# Altium project DC_Electronic_Load.PrjPcb
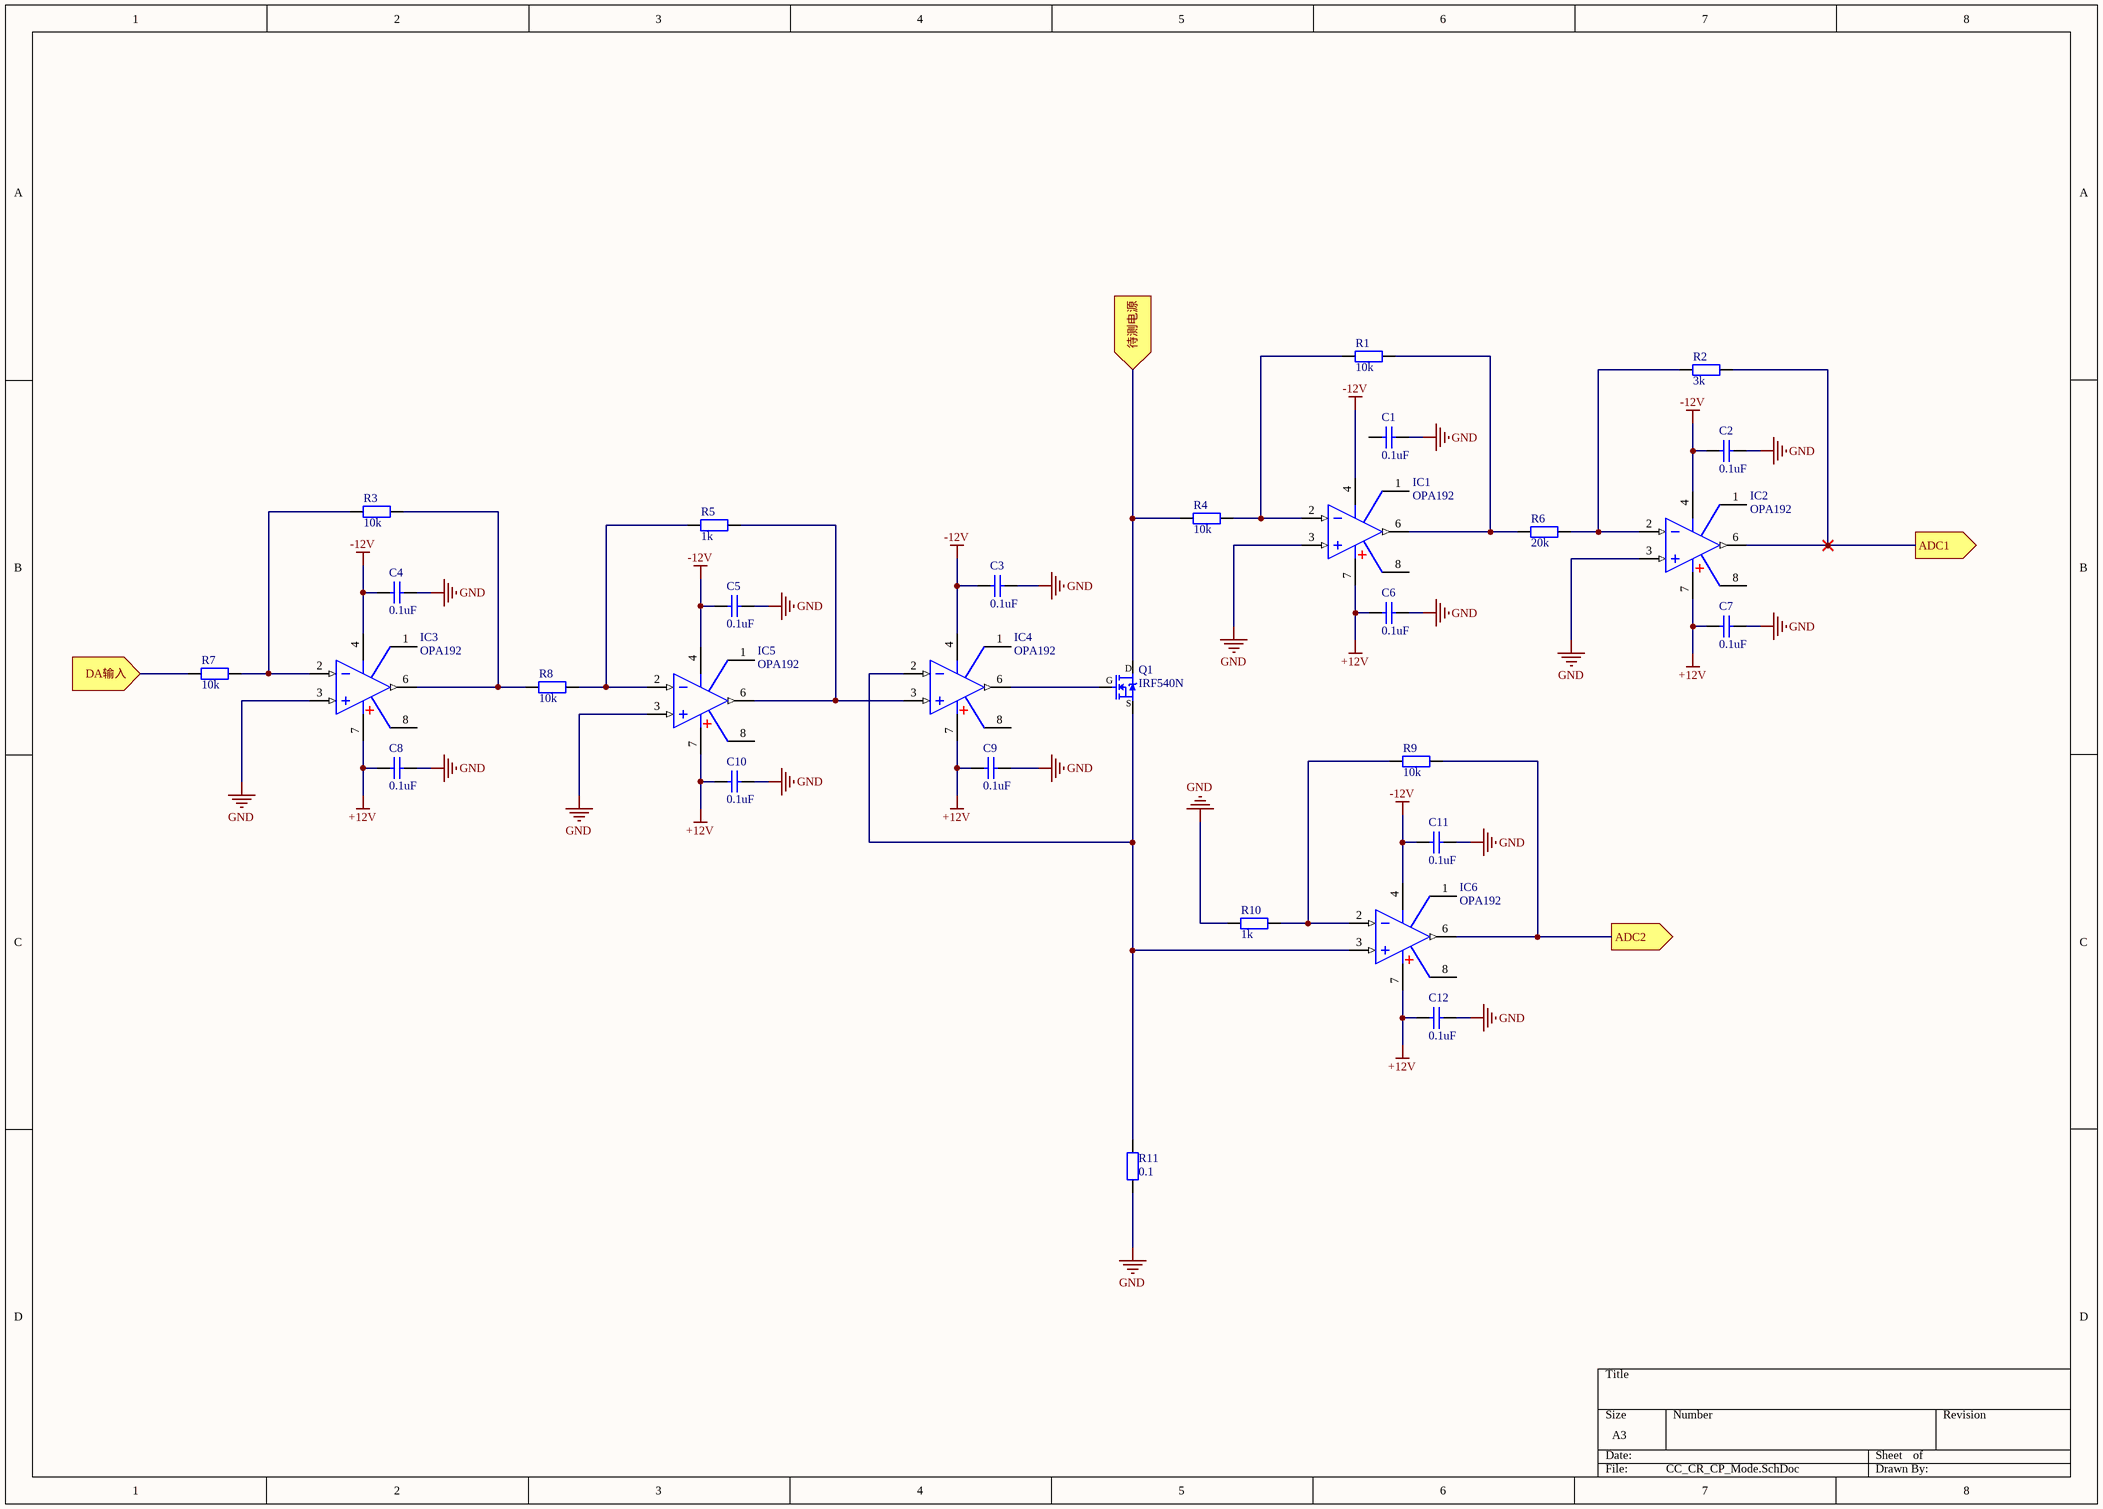
[diagram p0: CC_CR_CP_Mode.SchDoc]
4 sheets, 100 parts. Net scope: flat (ports and power ports of the same name join across sheets).
Board file: DC_Electronic_Load.PcbDoc
Sheets:
  CC_CR_CP_Mode.SchDoc
  CV_Mode.SchDoc
  Sheet1.SchDoc
  Sheet2.SchDoc

## Sheet CC_CR_CP_Mode.SchDoc
size A3; SheetNumber: 1; SheetTotal: 2

### Parts
C1  0.1uF  [瓷片电容]
C2  0.1uF  [瓷片电容]
C3  0.1uF  [瓷片电容]
C4  0.1uF  [瓷片电容]
C5  0.1uF  [瓷片电容]
C6  0.1uF  [瓷片电容]
C7  0.1uF  [瓷片电容]
C8  0.1uF  [瓷片电容]
C9  0.1uF  [瓷片电容]
C10  0.1uF  [瓷片电容]
C11  0.1uF  [瓷片电容]
C12  0.1uF  [瓷片电容]
IC1  OPA192  [SOP8_N]
IC2  OPA192  [SOP8_N]
IC3  OPA192  [SOP8_N]
IC4  OPA192  [SOP8_N]
IC5  OPA192  [SOP8_N]
IC6  OPA192  [SOP8_N]
Q1  IRF540N  [TO263-3B]
R1  10k  [RS 1/4W]
R2  3k  [RS 1/4W]
R3  10k  [RS 1/4W]
R4  10k  [RS 1/4W]
R5  1k  [RS 1/4W]
R6  20k  [RS 1/4W]
R7  10k  [RS 1/4W]
R8  10k  [RS 1/4W]
R9  10k  [RS 1/4W]
R10  1k  [RS 1/4W]
R11  0.1  [RS 1/4W]

### Ports
ADC1 (out), ADC2 (out), DA输入 (in), 待测电源 (in)

### Nets
+12V: C6.1 C7.1 C8.1 C9.1 C10.1 C12.1 IC1.7(V+) IC2.7(V+) IC3.7(V+) IC4.7(V+) IC5.7(V+) IC6.7(V+)
-12V: C2.1 C3.1 C4.1 C5.1 C11.1 IC1.4(V-) IC2.4(V-) IC3.4(V-) IC4.4(V-) IC5.4(V-) IC6.4(V-)
GND: C1.2 C2.2 C3.2 C4.2 C5.2 C6.2 C7.2 C8.2 C9.2 C10.2 C11.2 C12.2 IC1.3(IN+) IC2.3(IN+) IC3.3(IN+) IC5.3(IN+) R10.1 R11.1
NetIC1_2: IC1.2(IN-) R1.1 R4.2
NetIC1_6: IC1.6(OUT) R1.2 R6.1
NetIC2_2: IC2.2(IN-) R2.1 R6.2
NetIC2_6: IC2.6(OUT) R2.2 ; port ADC1
NetIC3_2: IC3.2(IN-) R3.1 R7.2
NetIC3_6: IC3.6(OUT) R3.2 R8.1
NetIC4_2: IC4.2(IN-) IC6.3(IN+) Q1.3(D) R11.2
NetIC4_3: IC4.3(IN+) IC5.6(OUT) R5.2
NetIC4_6: IC4.6(OUT) Q1.1(G)
NetIC5_2: IC5.2(IN-) R5.1 R8.2
NetIC6_2: IC6.2(IN-) R9.1 R10.2
NetIC6_6: IC6.6(OUT) R9.2 ; port ADC2
NetIC10_3: R7.1 ; port DA输入
NetQ1_2: Q1.2(S) R4.1 ; port 待测电源

Not connected (* = marked no-connect by the designer): C1 1; IC1 1 8; IC2 1 8; IC3 1 8; IC4 1 8; IC5 1 8; IC6 1 8

### Library data of the parts
C1-C12 = Cap_DIP: 直插电容; Value: 100nF; Voltage: 63V; Published: 8-Jun-2000; Revision: July-2002: Re-released for DXP Platform.; Publisher: Altium Limited; 实物样品照片: https://item.taobao.com/item.htm?spm=a230r.1.14.32.21fd24b7VWml4d&id=37914290992&ns=1&abbucket=13#detail
IC1-IC6 = OPA192: High-Voltage, Rail-to-Rail Input/Output, 5µV, 0.2µV/˚C, Precision Operational Amplifier; BOM名称: 单路精密运放; 版权归属: 源创客; 学习资源: www.ooocke.com
Q1 = IRF540N: N沟场 100V/22A; BOM名称: 效应管; 版权归属: 源创客; 学习资源: www.ooocke.com; 描述: N沟场 100V/22A
R1-R11 = Res_DIP: 直插电阻

## Sheet CV_Mode.SchDoc
size A3; SheetNumber: 2; SheetTotal: 4
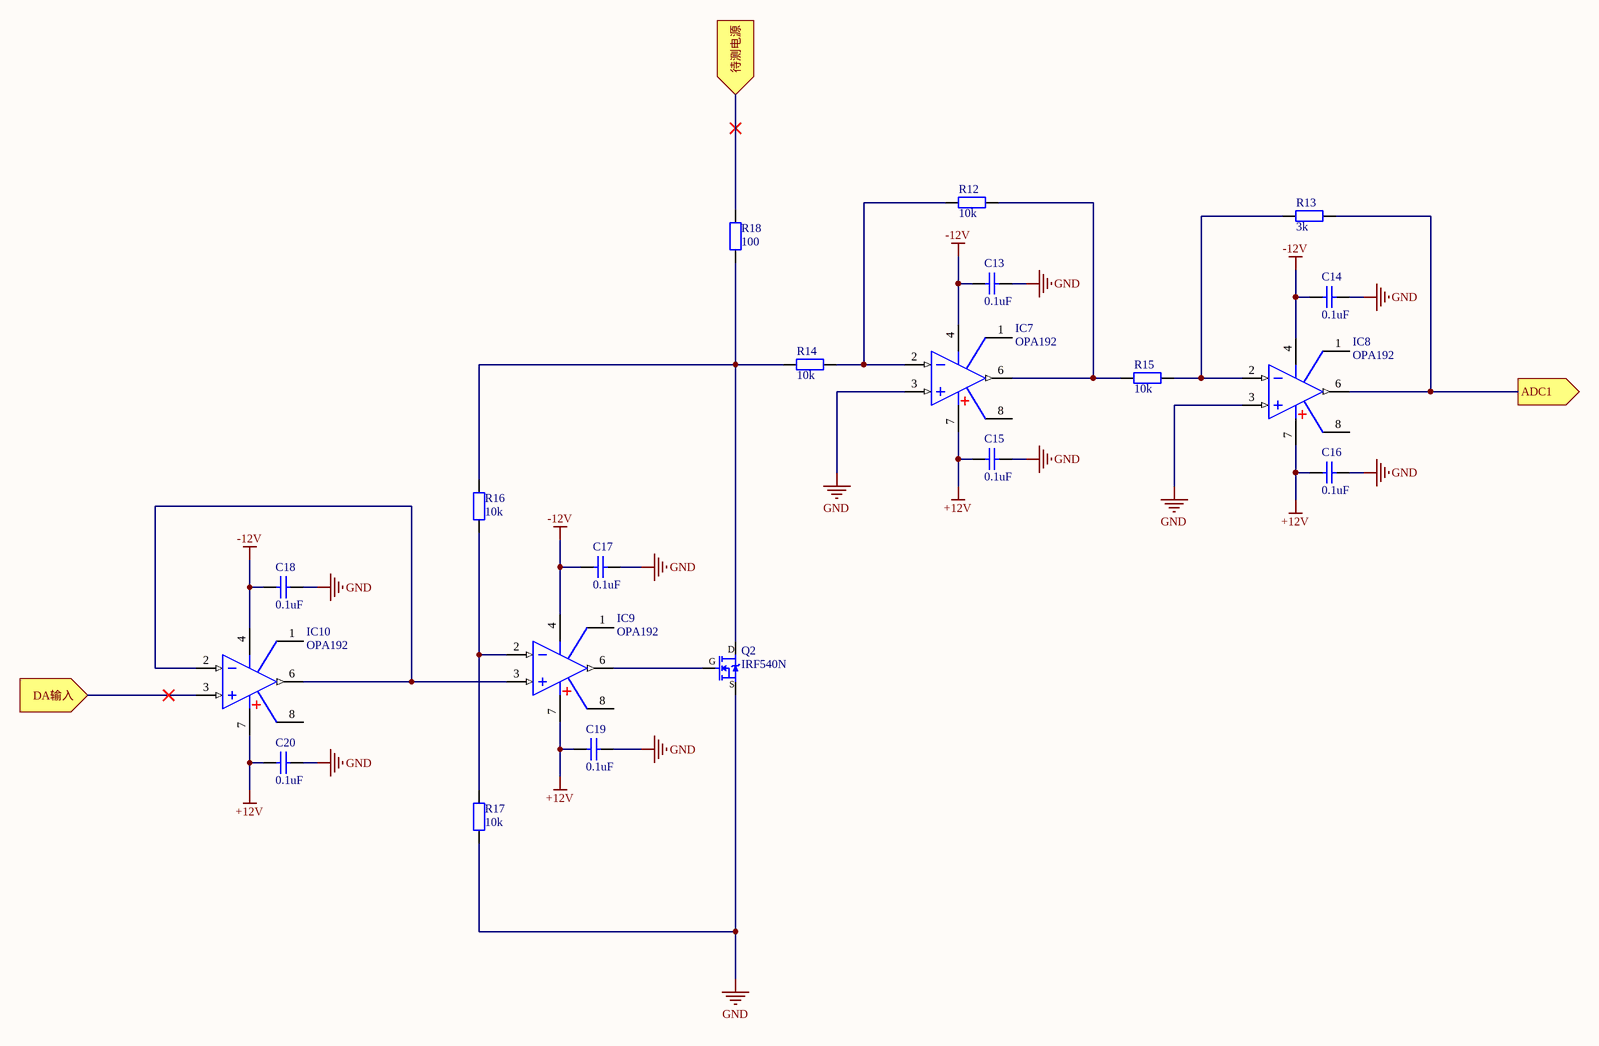
[diagram p1: CV_Mode.SchDoc]

### Parts
C13  0.1uF  [瓷片电容]
C14  0.1uF  [瓷片电容]
C15  0.1uF  [瓷片电容]
C16  0.1uF  [瓷片电容]
C17  0.1uF  [瓷片电容]
C18  0.1uF  [瓷片电容]
C19  0.1uF  [瓷片电容]
C20  0.1uF  [瓷片电容]
IC7  OPA192  [SOP8_N]
IC8  OPA192  [SOP8_N]
IC9  OPA192  [SOP8_N]
IC10  OPA192  [SOP8_N]
Q2  IRF540N  [TO263-3B]
R12  10k  [RS 1/4W]
R13  3k  [RS 1/4W]
R14  10k  [RS 1/4W]
R15  10k  [RS 1/4W]
R16  10k  [RS 1/4W]
R17  10k  [RS 1/4W]
R18  100  [RS 1/4W]

### Ports
ADC1 (out), DA输入 (in), 待测电源 (in)

### Nets
+12V: C15.1 C16.1 C19.1 C20.1 IC7.7(V+) IC8.7(V+) IC9.7(V+) IC10.7(V+)
-12V: C13.1 C14.1 C17.1 C18.1 IC7.4(V-) IC8.4(V-) IC9.4(V-) IC10.4(V-)
GND: C13.2 C14.2 C15.2 C16.2 C17.2 C18.2 C19.2 C20.2 IC7.3(IN+) IC8.3(IN+) Q2.3(D) R17.1
NetIC2_6: IC8.6(OUT) R13.2 ; port ADC1
NetIC7_2: IC7.2(IN-) R12.1 R14.2
NetIC7_6: IC7.6(OUT) R12.2 R15.1
NetIC8_2: IC8.2(IN-) R13.1 R15.2
NetIC9_2: IC9.2(IN-) R16.1 R17.2
NetIC9_3: IC9.3(IN+) IC10.2(IN-) IC10.6(OUT)
NetIC9_6: IC9.6(OUT) Q2.1(G)
NetIC10_3: IC10.3(IN+) ; port DA输入
NetQ1_2: R18.2 ; port 待测电源
NetQ2_2: Q2.2(S) R14.1 R16.2 R18.1

Not connected (* = marked no-connect by the designer): IC7 1 8; IC8 1 8; IC9 1 8; IC10 1 8

### Library data of the parts
C13-C20 = Cap_DIP: 直插电容; Value: 100nF; Voltage: 63V; Published: 8-Jun-2000; Revision: July-2002: Re-released for DXP Platform.; Publisher: Altium Limited; 实物样品照片: https://item.taobao.com/item.htm?spm=a230r.1.14.32.21fd24b7VWml4d&id=37914290992&ns=1&abbucket=13#detail
IC7-IC10 = OPA192: as IC1 on sheet CC_CR_CP_Mode; 学习资源: www.ooocke.com
Q2 = IRF540N: N沟场 100V/22A; BOM名称: 效应管; 版权归属: 源创客; 学习资源: www.ooocke.com; 描述: N沟场 100V/22A
R12-R18 = Res_DIP: 直插电阻

## Sheet Sheet1.SchDoc
size A4; SheetNumber: 3; SheetTotal: 4
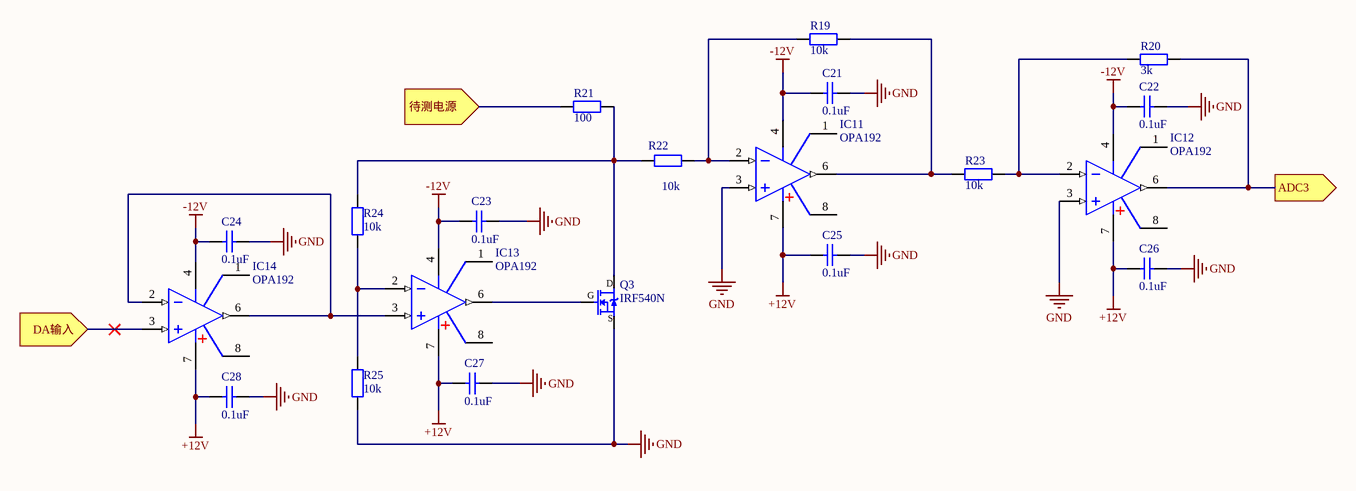
[diagram p2: Sheet1.SchDoc]

### Parts
C21  0.1uF  [瓷片电容]
C22  0.1uF  [瓷片电容]
C23  0.1uF  [瓷片电容]
C24  0.1uF  [瓷片电容]
C25  0.1uF  [瓷片电容]
C26  0.1uF  [瓷片电容]
C27  0.1uF  [瓷片电容]
C28  0.1uF  [瓷片电容]
IC11  OPA192  [SOP8_N]
IC12  OPA192  [SOP8_N]
IC13  OPA192  [SOP8_N]
IC14  OPA192  [SOP8_N]
Q3  IRF540N  [TO263-3B]
R19  10k  [RS 1/4W]
R20  3k  [RS 1/4W]
R21  100  [RS 1/4W]
R22  10k  [RS 1/4W]
R23  10k  [RS 1/4W]
R24  10k  [RS 1/4W]
R25  10k  [RS 1/4W]

### Ports
ADC3 (out), DA输入 (in), 待测电源 (in)

### Nets
+12V: C25.1 C26.1 C27.1 C28.1 IC11.7(V+) IC12.7(V+) IC13.7(V+) IC14.7(V+)
-12V: C21.1 C22.1 C23.1 C24.1 IC11.4(V-) IC12.4(V-) IC13.4(V-) IC14.4(V-)
GND: C21.2 C22.2 C23.2 C24.2 C25.2 C26.2 C27.2 C28.2 IC11.3(IN+) IC12.3(IN+) Q3.3(D) R25.1
NetIC10_3: IC14.3(IN+) ; port DA输入
NetIC11_2: IC11.2(IN-) R19.1 R22.2
NetIC11_6: IC11.6(OUT) R19.2 R23.1
NetIC12_2: IC12.2(IN-) R20.1 R23.2
NetIC12_6: IC12.6(OUT) R20.2 ; port ADC3
NetIC13_2: IC13.2(IN-) R24.1 R25.2
NetIC13_3: IC13.3(IN+) IC14.2(IN-) IC14.6(OUT)
NetIC13_6: IC13.6(OUT) Q3.1(G)
NetQ1_2: R21.2 ; port 待测电源
NetQ3_2: Q3.2(S) R21.1 R22.1 R24.2

Not connected (* = marked no-connect by the designer): IC11 1 8; IC12 1 8; IC13 1 8; IC14 1 8

### Library data of the parts
C21-C28 = Cap_DIP: 直插电容; Value: 100nF; Voltage: 63V; Published: 8-Jun-2000; Revision: July-2002: Re-released for DXP Platform.; Publisher: Altium Limited; 实物样品照片: https://item.taobao.com/item.htm?spm=a230r.1.14.32.21fd24b7VWml4d&id=37914290992&ns=1&abbucket=13#detail
IC11-IC14 = OPA192: as IC1 on sheet CC_CR_CP_Mode; 学习资源: www.ooocke.com
Q3 = IRF540N: N沟场 100V/22A; BOM名称: 效应管; 版权归属: 源创客; 学习资源: www.ooocke.com; 描述: N沟场 100V/22A
R19-R25 = Res_DIP: 直插电阻

## Sheet Sheet2.SchDoc
size A3; SheetNumber: 4; SheetTotal: 4
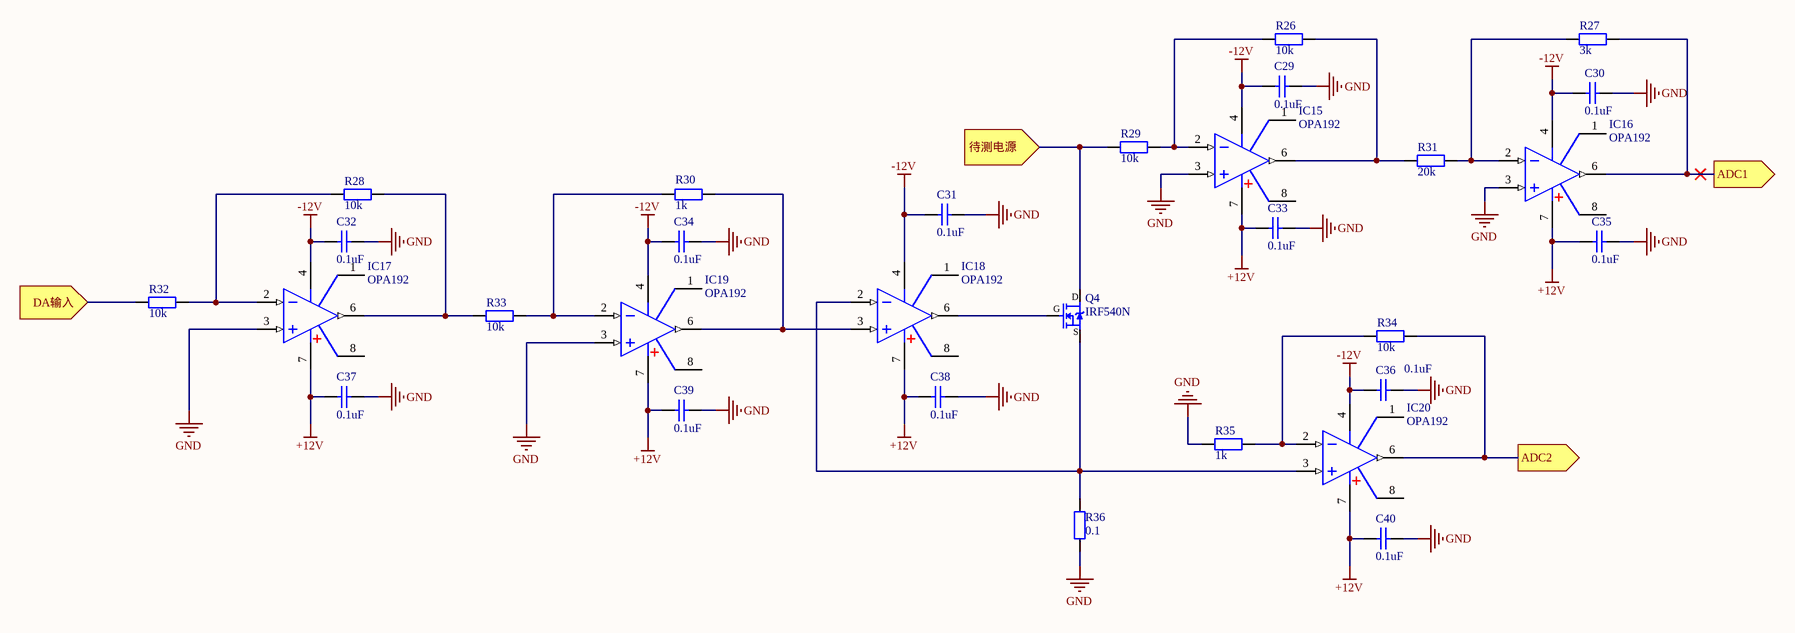
[diagram p3: Sheet2.SchDoc]

### Parts
C29  0.1uF  [瓷片电容]
C30  0.1uF  [瓷片电容]
C31  0.1uF  [瓷片电容]
C32  0.1uF  [瓷片电容]
C33  0.1uF  [瓷片电容]
C34  0.1uF  [瓷片电容]
C35  0.1uF  [瓷片电容]
C36  0.1uF  [瓷片电容]
C37  0.1uF  [瓷片电容]
C38  0.1uF  [瓷片电容]
C39  0.1uF  [瓷片电容]
C40  0.1uF  [瓷片电容]
IC15  OPA192  [SOP8_N]
IC16  OPA192  [SOP8_N]
IC17  OPA192  [SOP8_N]
IC18  OPA192  [SOP8_N]
IC19  OPA192  [SOP8_N]
IC20  OPA192  [SOP8_N]
Q4  IRF540N  [TO263-3B]
R26  10k  [RS 1/4W]
R27  3k  [RS 1/4W]
R28  10k  [RS 1/4W]
R29  10k  [RS 1/4W]
R30  1k  [RS 1/4W]
R31  20k  [RS 1/4W]
R32  10k  [RS 1/4W]
R33  10k  [RS 1/4W]
R34  10k  [RS 1/4W]
R35  1k  [RS 1/4W]
R36  0.1  [RS 1/4W]

### Ports
ADC1 (out), ADC2 (out), DA输入 (in), 待测电源 (in)

### Nets
+12V: C33.1 C35.1 C37.1 C38.1 C39.1 C40.1 IC15.7(V+) IC16.7(V+) IC17.7(V+) IC18.7(V+) IC19.7(V+) IC20.7(V+)
-12V: C29.1 C30.1 C31.1 C32.1 C34.1 C36.1 IC15.4(V-) IC16.4(V-) IC17.4(V-) IC18.4(V-) IC19.4(V-) IC20.4(V-)
GND: C29.2 C30.2 C31.2 C32.2 C33.2 C34.2 C35.2 C36.2 C37.2 C38.2 C39.2 C40.2 IC15.3(IN+) IC16.3(IN+) IC17.3(IN+) IC19.3(IN+) R35.1 R36.1
NetIC2_6: IC16.6(OUT) R27.2 ; port ADC1
NetIC6_6: IC20.6(OUT) R34.2 ; port ADC2
NetIC10_3: R32.1 ; port DA输入
NetIC15_2: IC15.2(IN-) R26.1 R29.2
NetIC15_6: IC15.6(OUT) R26.2 R31.1
NetIC16_2: IC16.2(IN-) R27.1 R31.2
NetIC17_2: IC17.2(IN-) R28.1 R32.2
NetIC17_6: IC17.6(OUT) R28.2 R33.1
NetIC18_2: IC18.2(IN-) IC20.3(IN+) Q4.3(D) R36.2
NetIC18_3: IC18.3(IN+) IC19.6(OUT) R30.2
NetIC18_6: IC18.6(OUT) Q4.1(G)
NetIC19_2: IC19.2(IN-) R30.1 R33.2
NetIC20_2: IC20.2(IN-) R34.1 R35.2
NetQ1_2: Q4.2(S) R29.1 ; port 待测电源

Not connected (* = marked no-connect by the designer): IC15 1 8; IC16 1 8; IC17 1 8; IC18 1 8; IC19 1 8; IC20 1 8

### Library data of the parts
C29-C40 = Cap_DIP: 直插电容; Value: 100nF; Voltage: 63V; Published: 8-Jun-2000; Revision: July-2002: Re-released for DXP Platform.; Publisher: Altium Limited; 实物样品照片: https://item.taobao.com/item.htm?spm=a230r.1.14.32.21fd24b7VWml4d&id=37914290992&ns=1&abbucket=13#detail
IC15-IC20 = OPA192: as IC1 on sheet CC_CR_CP_Mode; 学习资源: www.ooocke.com
Q4 = IRF540N: N沟场 100V/22A; BOM名称: 效应管; 版权归属: 源创客; 学习资源: www.ooocke.com; 描述: N沟场 100V/22A
R26-R36 = Res_DIP: 直插电阻

## Nets that join several sheets
+12V: CC_CR_CP_Mode (12 pins), CV_Mode (8 pins), Sheet1 (8 pins), Sheet2 (12 pins)
-12V: CC_CR_CP_Mode (11 pins), CV_Mode (8 pins), Sheet1 (8 pins), Sheet2 (12 pins)
GND: CC_CR_CP_Mode (18 pins), CV_Mode (12 pins), Sheet1 (12 pins), Sheet2 (18 pins)
NetIC2_6: CC_CR_CP_Mode (IC2.6 R2.2), CV_Mode (IC8.6 R13.2), Sheet2 (IC16.6 R27.2)
NetIC6_6: CC_CR_CP_Mode (IC6.6 R9.2), Sheet2 (IC20.6 R34.2)
NetIC10_3: CC_CR_CP_Mode (R7.1), CV_Mode (IC10.3), Sheet1 (IC14.3), Sheet2 (R32.1)
NetQ1_2: CC_CR_CP_Mode (Q1.2 R4.1), CV_Mode (R18.2), Sheet1 (R21.2), Sheet2 (Q4.2 R29.1)